# EAGLE schematic BQ24070_MAX_LTC (EAGLE 9.3.0)

## Sheet 1 of 2
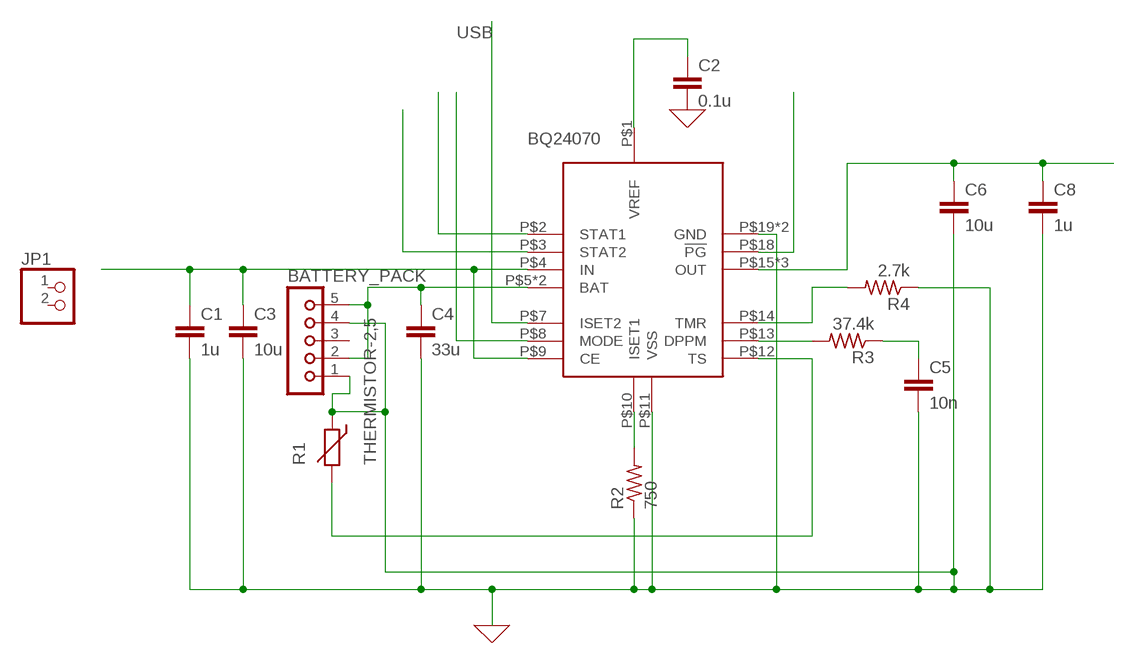
[diagram p0: schematic, sheet 1]

### Parts
BATTERY_PACK  JU05  [JU05]
C1  1u  C-EU025-024X044  [C025-024X044]
C2  0.1u  C-EU025-024X044  [C025-024X044]
C3  10u  C-EU025-024X044  [C025-024X044]
C4  33u  C-EU025-024X044  [C025-024X044]
C5  10n  C-EU025-024X044  [C025-024X044]
C6  10u  C-EU025-024X044  [C025-024X044]
C8  1u  C-EU025-024X044  [C025-024X044]
JP1  PINHD-1X2  [1X02]
R1  THERMISTOR-2,5  [RS-2,5]
R2  750  R-US_0204/2V  [0204V]
R3  37.4k  R-US_0204/2V  [0204V]
R4  2.7k  R-US_0204/2V  [0204V]
U$1  BQ24070  [R-PVQFN-N20]

### Nets
0: C2.2 ; supply symbol labelled GND ; also sheet 2
N$1: C1.1 C3.1 U$1.P$4(IN) U$1.P$9(CE)
N$2: BATTERY_PACK.1 BATTERY_PACK.4 C1.2 C3.2 C4.2 C5.2 C6.2 C8.2 R1.1 R2.1 R4.1 U$1.P$11(VSS) U$1.P$19(GND) U$1.P$20(GND) ; supply symbol labelled GND
N$3: C2.1 U$1.P$1(VREF)
N$4: C6.1 C8.1 U$1.P$15(OUT) U$1.P$16(OUT) U$1.P$17(OUT)
N$5: BATTERY_PACK.2 BATTERY_PACK.5 C4.1 U$1.P$5(BAT) U$1.P$6(BAT)
N$6: R1.2 U$1.P$12(TS)
N$7: R2.2 U$1.P$10(ISET1)
N$8: R3.2 U$1.P$13(DPPM)
N$9: C5.1 R3.1
N$10: U$1.P$2(STAT1)
N$11: U$1.P$3(STAT2)
N$12: R4.2 U$1.P$14(TMR)
N$13: U$1.P$8(MODE)
N$14: U$1.P$18(!PG)
USB: U$1.P$7(ISET2)
Unconnected: BATTERY_PACK.3 JP1.1 JP1.2

## Sheet 2 of 2
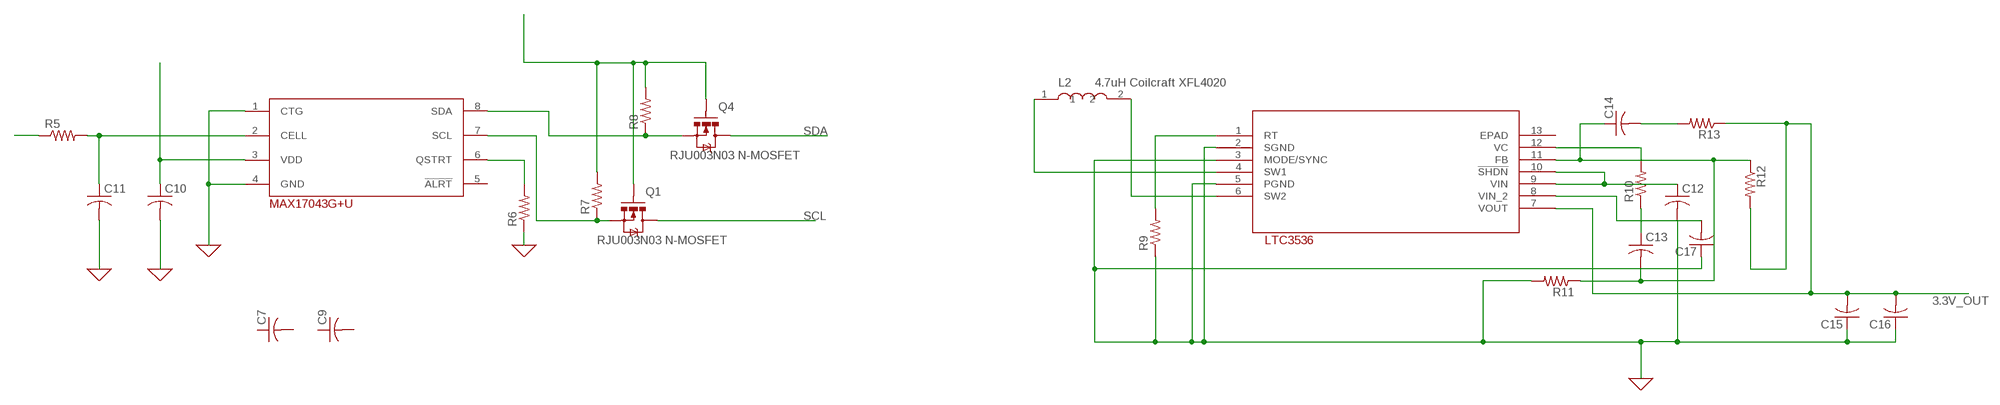
[diagram p1: schematic, sheet 2]

### Parts
C7  C-US050-024X044  [C050-024X044]
C9  C-US050-024X044  [C050-024X044]
C10  C-US050-024X044  [C050-024X044]
C11  C-US050-024X044  [C050-024X044]
C12  C-US050-024X044  [C050-024X044]
C13  C-US050-024X044  [C050-024X044]
C14  C-US050-024X044  [C050-024X044]
C15  C-US050-024X044  [C050-024X044]
C16  C-US050-024X044  [C050-024X044]
C17  C-US050-024X044  [C050-024X044]
L2  4.7uH Coilcraft XFL4020  INDUCTOR  [XFL4020]
Q1  RJU003N03 N-MOSFET  MOSFET-NSOT-323  [SOT32-3]
Q4  RJU003N03 N-MOSFET  MOSFET-NSOT-323  [SOT32-3]
R5  R-US_0204/2V  [0204V]
R6  R-US_0204/2V  [0204V]
R7  R-US_0204/2V  [0204V]
R8  R-US_0204/2V  [0204V]
R9  R-US_0204/2V  [0204V]
R10  R-US_0204/2V  [0204V]
R11  R-US_0204/2V  [0204V]
R12  R-US_0204/2V  [0204V]
R13  R-US_0204/2V  [0204V]
U1  LTC3536EMSETRPBF  [MSOP-12_MSE]
U$2  MAX17043G+U  [SON50P200X300X80-9N]

### Nets
0: C10.2 C11.2 C12.2 C15.1 C16.1 C17.1 R6.1 R9.1 R11.2 U1.2(SGND) U1.3(MODE/SYNC) U1.5(PGND) U$2.1(CTG) U$2.4(GND) ; supply symbol labelled GND ; also sheet 1
3.3V_OUT: C15.2 C16.2 R12.2 R13.1 U1.7(VOUT)
N$15: C11.1 R5.2 U$2.2(CELL)
N$16: C10.1 U$2.3(VDD)
N$17: R6.2 U$2.6(QSTRT)
N$18: Q1.2(S) R7.1 U$2.7(SCL)
N$19: R5.1
N$20: Q4.2(S) R8.1 U$2.8(SDA)
N$21: L2.1 U1.4(SW1)
N$22: L2.2 U1.6(SW2)
N$23: Q1.1(G) Q4.1(G) R7.2 R8.2
N$24: C17.2 U1.8(VIN_2)
N$25: R9.2 U1.1(RT)
N$26: R10.2 U1.12(VC)
N$27: C13.1 R10.1
N$28: C12.1 U1.9(VIN) U1.10(!SHDN)
N$29: C13.2 C14.1 R11.1 R12.1 U1.11(FB)
N$30: C14.2 R13.2
SCL: Q1.3(D)
SDA: Q4.3(D)
Unconnected: C7.1 C7.2 C9.1 C9.2 U1.13(EPAD) U$2.5(!ALRT)

## Library data of the parts
BATTERY_PACK = con-lsta:JU05: PIN HEADER; OC_FARNELL: unknown; OC_NEWARK: unknown
C1-C6 C8 = rcl:C-EU: CAPACITOR, European symbol; SPICEPREFIX: C
C7 C9-C17 = rcl:C-US: CAPACITOR, American symbol; SPICEPREFIX: C
JP1 = pinhead:PINHD-1X2: PIN HEADER
L2 = freetronics-jon:INDUCTOR
Q1 Q4 = freetronics-jon:MOSFET-N: Basic N-Channel MOSFET
R1 = varistor:THERMISTOR: THERMISTOR
R2-R13 = rcl:R-US_: RESISTOR, American symbol; SPICEPREFIX: R
U1 = LTC3536EMSETRPBF:LTC3536EMSETRPBF; DESCRIPTION: LTC3536 - 1A Low Noise, Buck-Boost DC/DC Converter; DIGI-KEY_PART_NUMBER: LTC3536EMSE#TRPBFCT-ND; DIGI-KEY_PURCHASE_URL: https://www.digikey.com/product-detail/en/linear-technology-analog-devices/LTC3536EMSE-TRPBF/LTC3536EMSE-TRPBFCT-ND/9761035?utm_source=snapeda&utm_medium=aggregator&utm_campaign=symbol; MF: Linear Technology/Analog; MP: LTC3536EMSE#TRPBF; PACKAGE: TSSOP-12 Linear Technology
U$1 = BQ24070:BQ24070; AVAILABILITY: Unavailable; DESCRIPTION: The bq24070 and bq24071 are highly integrated Li-ion linear charger and system power-path management devices targeted...; MF: Texas Instruments; MP: BQ24070; PACKAGE: None; PRICE: None
U$2 = SON50P200X300X80-9N:MAX17043G+U